# EAGLE schematic top PCB (EAGLE 7.2.0)
CNAME: SHF ROBOTICS; CREVISION: 1; DESIGNER: TOM HULBERT
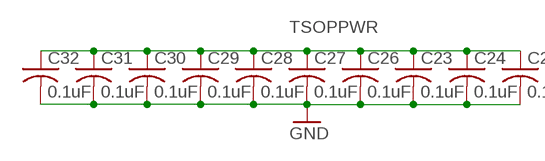
[diagram p0: schematic, sheet 1, part 1 of 2]
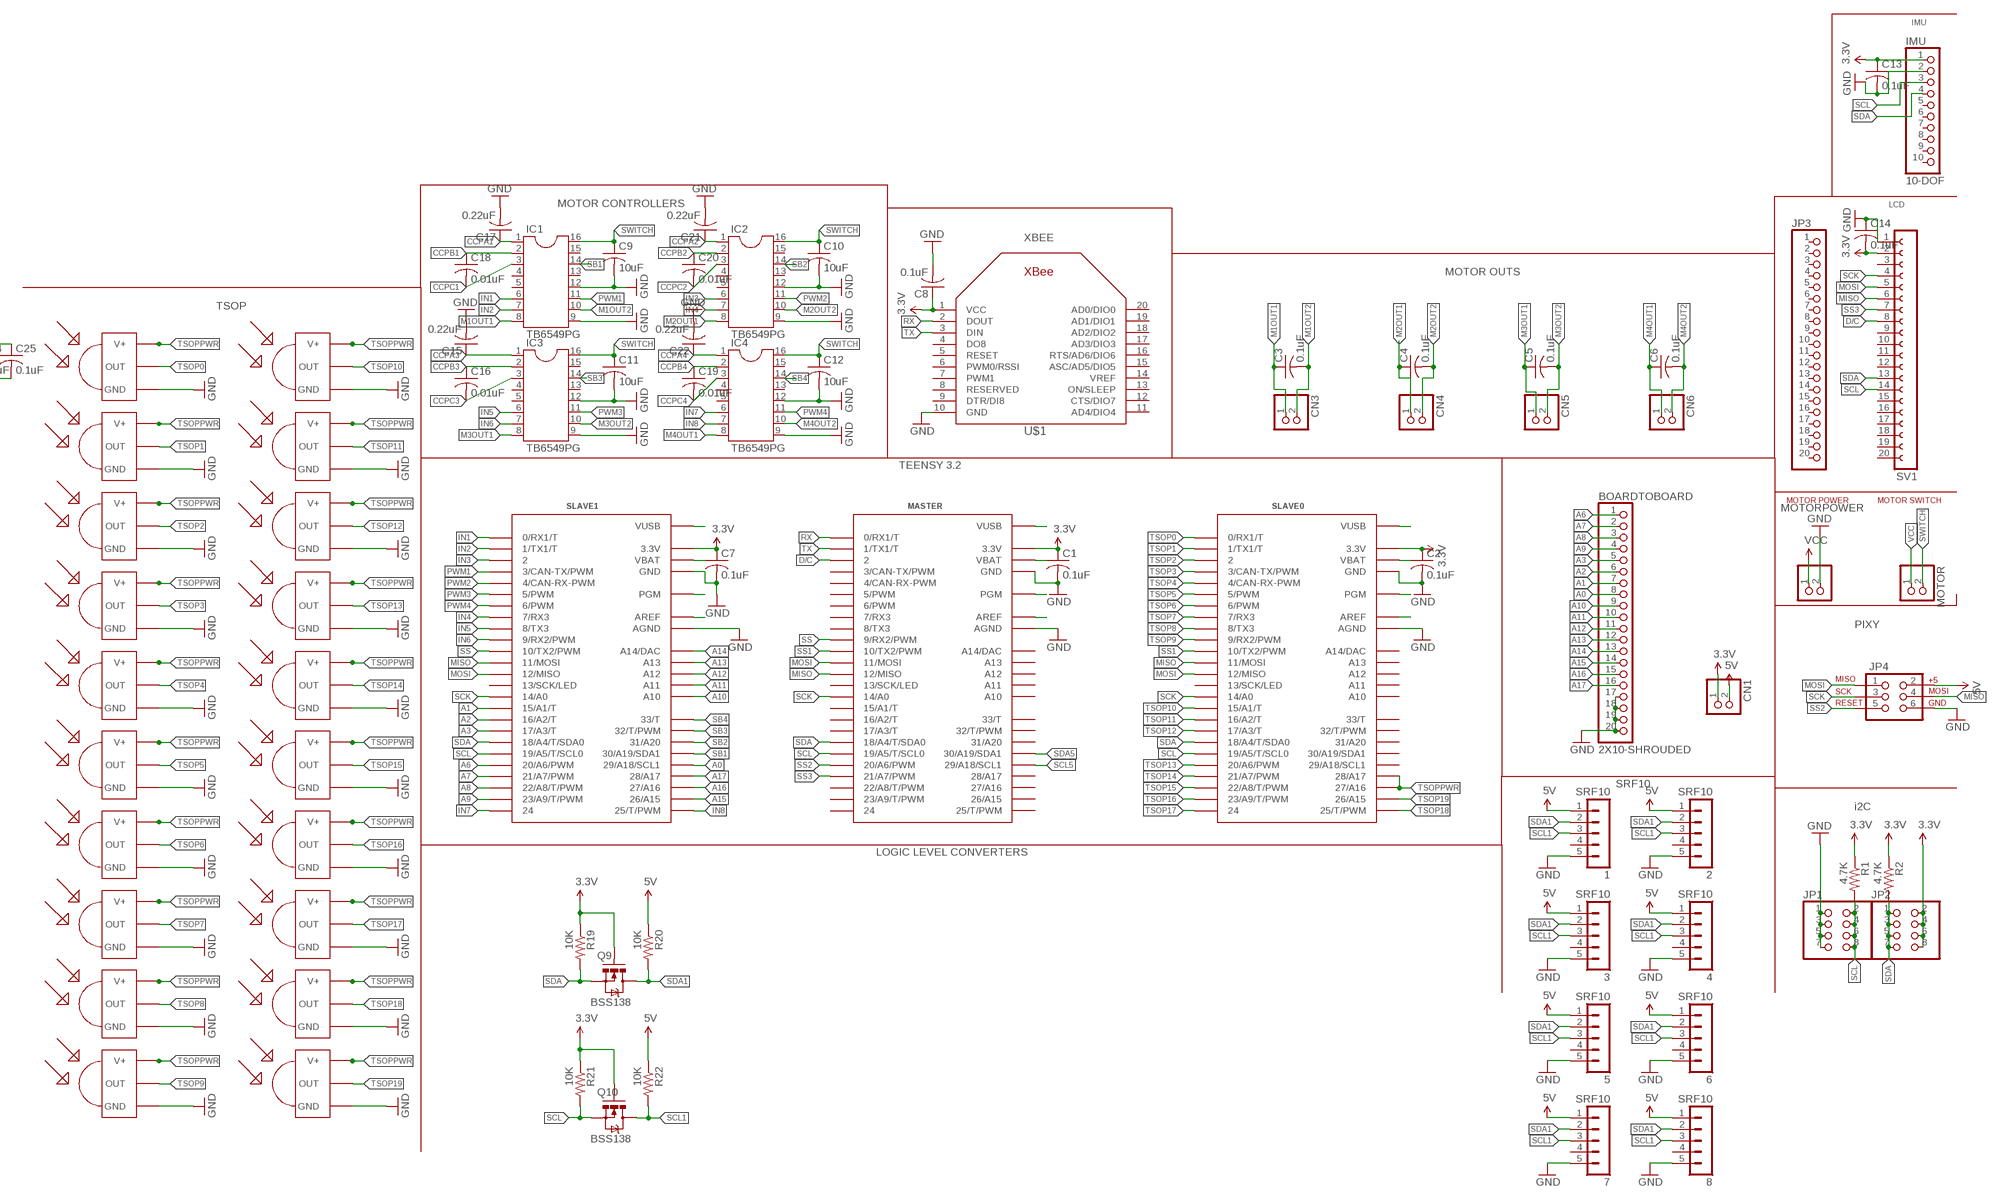
[diagram p1: schematic, sheet 1, part 2 of 2]

## Parts
1  SRF10  MA05-1  [MA05-1]
2  SRF10  MA05-1  [MA05-1]
3  SRF10  MA05-1  [MA05-1]
4  SRF10  MA05-1  [MA05-1]
5  SRF10  MA05-1  [MA05-1]
6  SRF10  MA05-1  [MA05-1]
7  SRF10  MA05-1  [MA05-1]
8  SRF10  MA05-1  [MA05-1]
BOARDTOBOARD  2X10-SHROUDED  [2X10-SHROUDED]
C1  0.1uF  C-USC0805  [C0805]
C2  0.1uF  C-USC0805  [C0805]
C3  0.1uF  C-USC0805  [C0805]
C4  0.1uF  C-USC0805  [C0805]
C5  0.1uF  C-USC0805  [C0805]
C6  0.1uF  C-USC0805  [C0805]
C7  0.1uF  C-USC0805  [C0805]
C8  0.1uF  C-USC0805  [C0805]
C9  10uF  C-USC0805  [C0805]
C10  10uF  C-USC0805  [C0805]
C11  10uF  C-USC0805  [C0805]
C12  10uF  C-USC0805  [C0805]
C13  0.1uF  C-USC0805  [C0805]
C14  0.1uF  C-USC0805  [C0805]
C15  0.22uF  C-USC0805  [C0805]
C16  0.01uF  C-USC0805  [C0805]
C17  0.22uF  C-USC0805  [C0805]
C18  0.01uF  C-USC0805  [C0805]
C19  0.01uF  C-USC0805  [C0805]
C20  0.01uF  C-USC0805  [C0805]
C21  0.22uF  C-USC0805  [C0805]
C22  0.22uF  C-USC0805  [C0805]
C23  0.1uF  C-USC0805  [C0805]
C24  0.1uF  C-USC0805  [C0805]
C25  0.1uF  C-USC0805  [C0805]
C26  0.1uF  C-USC0805  [C0805]
C27  0.1uF  C-USC0805  [C0805]
C28  0.1uF  C-USC0805  [C0805]
C29  0.1uF  C-USC0805  [C0805]
C30  0.1uF  C-USC0805  [C0805]
C31  0.1uF  C-USC0805  [C0805]
C32  0.1uF  C-USC0805  [C0805]
CN1  JST_2PIN-SMT  [JST-PH-2-SMT]
CN3  JST_2PIN-SMT  [JST-PH-2-SMT]
CN4  JST_2PIN-SMT  [JST-PH-2-SMT]
CN5  JST_2PIN-SMT  [JST-PH-2-SMT]
CN6  JST_2PIN-SMT  [JST-PH-2-SMT]
IC1  TB6549PG  DIL16  [DIL16]
IC2  TB6549PG  DIL16  [DIL16]
IC3  TB6549PG  DIL16  [DIL16]
IC4  TB6549PG  DIL16  [DIL16]
IMU  10-DOF  PINHD-1X10  [1X10-BIG]
JP1  PINHD-2X4  [2X04]
JP2  PINHD-2X4  [2X04]
JP3  PINHD-1X20  [1X20]
JP4  AVR_SPI_PRG_6PTH  [2X3]
MASTER  TEENSY_3.1_ALL_PINS_AND_PADS-VIN  [TEENSY_3.1_ALLPINS-VIN]
MOTOR  JST_2PIN-SMT  [JST-PH-2-SMT]
MOTORPOWER  JST_2PIN-SMT  [JST-PH-2-SMT]
Q9  BSS138  MOSFET-NCHANNELSMD  [SOT23-3]
Q10  BSS138  MOSFET-NCHANNELSMD  [SOT23-3]
R1  4.7K  R-US_R0805  [R0805]
R2  4.7K  R-US_R0805  [R0805]
R19  10K  RESISTOR0603-RES  [0603-RES]
R20  10K  RESISTOR0603-RES  [0603-RES]
R21  10K  RESISTOR0603-RES  [0603-RES]
R22  10K  RESISTOR0603-RES  [0603-RES]
SLAVE0  TEENSY_3.1_ALL_PINS_AND_PADS-VIN  [TEENSY_3.1_ALLPINS-VIN]
SLAVE1  TEENSY_3.1_ALL_PINS_AND_PADS-VIN  [TEENSY_3.1_ALLPINS-VIN]
SV1  FE20-1  [FE20]
TSOP1  TSOP1730  [TSOP17XX]
TSOP2  TSOP1730  [TSOP17XX]
TSOP3  TSOP1730  [TSOP17XX]
TSOP4  TSOP1730  [TSOP17XX]
TSOP5  TSOP1730  [TSOP17XX]
TSOP6  TSOP1730  [TSOP17XX]
TSOP7  TSOP1730  [TSOP17XX]
TSOP8  TSOP1730  [TSOP17XX]
TSOP9  TSOP1730  [TSOP17XX]
TSOP10  TSOP1730  [TSOP17XX]
TSOP11  TSOP1730  [TSOP17XX]
TSOP12  TSOP1730  [TSOP17XX]
TSOP13  TSOP1730  [TSOP17XX]
TSOP14  TSOP1730  [TSOP17XX]
TSOP15  TSOP1730  [TSOP17XX]
TSOP16  TSOP1730  [TSOP17XX]
TSOP17  TSOP1730  [TSOP17XX]
TSOP18  TSOP1730  [TSOP17XX]
TSOP19  TSOP1730  [TSOP17XX]
TSOP20  TSOP1730  [TSOP17XX]
U$1  XBEE  [XBEE]

## Nets
3.3V: C1.1 C2.1 C7.1 C8.1 C13.1 C14.2 CN1.1 IMU.1 JP2.2 JP2.4 JP2.6 JP2.8 MASTER.3.3V MASTER.3.3V1(3.3V) MASTER.3.3V2(3.3V) Q9.1(G) Q10.1(G) R1.1 R2.1 R19.1 R21.1 SLAVE0.3.3V SLAVE0.3.3V1(3.3V) SLAVE0.3.3V2(3.3V) SLAVE1.3.3V SLAVE1.3.3V1(3.3V) SLAVE1.3.3V2(3.3V) SV1.2 U$1.1(VCC)
5V: 1.1 2.1 3.1 4.1 5.1 6.1 7.1 8.1 CN1.2 JP4.2 R20.1 R22.1
A0: BOARDTOBOARD.8 SLAVE1.29(29/A18/SCL1)
A1: BOARDTOBOARD.7 SLAVE1.15/A1(15/A1/T)
A2: BOARDTOBOARD.6 SLAVE1.16/A2(16/A2/T)
A3: BOARDTOBOARD.5 SLAVE1.17/A3(17/A3/T)
A6: BOARDTOBOARD.1 SLAVE1.20/A6(20/A6/PWM)
A7: BOARDTOBOARD.2 SLAVE1.21/A7(21/A7/PWM)
A8: BOARDTOBOARD.3 SLAVE1.22/A8(22/A8/T/PWM)
A9: BOARDTOBOARD.4 SLAVE1.23/A9(23/A9/T/PWM)
A10: BOARDTOBOARD.9 SLAVE1.A10
A11: BOARDTOBOARD.10 SLAVE1.A11
A12: BOARDTOBOARD.11 SLAVE1.A12
A13: BOARDTOBOARD.12 SLAVE1.A13
A14: BOARDTOBOARD.13 SLAVE1.A14(A14/DAC)
A15: BOARDTOBOARD.14 SLAVE1.26(26/A15)
A16: BOARDTOBOARD.15 SLAVE1.27(27/A16)
A17: BOARDTOBOARD.16 SLAVE1.28(28/A17)
CCPA1: C17.1 IC1.1
CCPA2: C21.1 IC2.1
CCPA3: C15.1 IC3.1
CCPA4: C22.1 IC4.1
CCPB1: C18.1 IC1.2
CCPB2: C20.1 IC2.2
CCPB3: C16.1 IC3.2
CCPB4: C19.1 IC4.2
CCPC1: C18.2 IC1.3
CCPC2: C20.2 IC2.3
CCPC3: C16.2 IC3.3
CCPC4: C19.2 IC4.3
D/C: MASTER.2 SV1.8
GND: 1.5 2.5 3.5 4.5 5.5 6.5 7.5 8.5 BOARDTOBOARD.17 BOARDTOBOARD.18 BOARDTOBOARD.19 BOARDTOBOARD.20 C1.2 C2.2 C7.2 C8.2 C9.2 C10.2 C11.2 C12.2 C13.2 C14.1 C15.2 C17.2 C21.2 C22.2 C23.2 C24.2 C25.2 C26.2 C27.2 C28.2 C29.2 C30.2 C31.2 C32.2 IC1.9 IC1.12 IC2.9 IC2.12 IC3.9 IC3.12 IC4.9 IC4.12 IMU.2 JP1.1 JP1.3 JP1.5 JP1.7 JP4.6 MASTER.AGND MASTER.GND MASTER.GND1(GND) MASTER.GND2(GND) MOTORPOWER.2 SLAVE0.AGND SLAVE0.GND SLAVE0.GND1(GND) SLAVE0.GND2(GND) SLAVE1.AGND SLAVE1.GND SLAVE1.GND1(GND) SLAVE1.GND2(GND) SV1.1 TSOP1.GND TSOP2.GND TSOP3.GND TSOP4.GND TSOP5.GND TSOP6.GND TSOP7.GND TSOP8.GND TSOP9.GND TSOP10.GND TSOP11.GND TSOP12.GND TSOP13.GND TSOP14.GND TSOP15.GND TSOP16.GND TSOP17.GND TSOP18.GND TSOP19.GND TSOP20.GND U$1.10(GND)
IN1: IC1.6 SLAVE1.0(0/RX1/T)
IN2: IC1.7 SLAVE1.1(1/TX1/T)
IN3: IC2.6 SLAVE1.2
IN4: IC2.7 SLAVE1.7(7/RX3)
IN5: IC3.6 SLAVE1.8(8/TX3)
IN6: IC3.7 SLAVE1.9(9/RX2/PWM)
IN7: IC4.6 SLAVE1.24
IN8: IC4.7 SLAVE1.25(25/T/PWM)
M1OUT1: C3.1 CN3.1 IC1.8
M1OUT2: C3.2 CN3.2 IC1.10
M2OUT1: C4.1 CN4.1 IC2.8
M2OUT2: C4.2 CN4.2 IC2.10
M3OUT1: C5.1 CN5.1 IC3.8
M3OUT2: C5.2 CN5.2 IC3.10
M4OUT1: C6.1 CN6.1 IC4.8
M4OUT2: C6.2 CN6.2 IC4.10
MISO: JP4.4 MASTER.12(12/MISO) SLAVE0.11(11/MOSI) SLAVE1.11(11/MOSI) SV1.6
MOSI: JP4.1 MASTER.11(11/MOSI) SLAVE0.12(12/MISO) SLAVE1.12(12/MISO) SV1.5
NC: SLAVE1.VUSB
NC1: SLAVE1.PGM
NC2: SLAVE1.AREF
NC3: SLAVE1.VBAT
NC4: MASTER.VUSB
NC5: MASTER.VBAT
NC6: MASTER.PGM
NC7: MASTER.AREF
NC8: SLAVE0.VUSB
NC9: SLAVE0.PGM
NC10: SLAVE0.AREF
NC11: SLAVE0.VBAT
PWM1: IC1.11 SLAVE1.3(3/CAN-TX/PWM)
PWM2: IC2.11 SLAVE1.4(4/CAN-RX-PWM)
PWM3: IC3.11 SLAVE1.5(5/PWM)
PWM4: IC4.11 SLAVE1.6(6/PWM)
RX: MASTER.0(0/RX1/T) U$1.2(DOUT)
SB1: IC1.14 SLAVE1.30(30/A19/SDA1)
SB2: IC2.14 SLAVE1.31(31/A20)
SB3: IC3.14 SLAVE1.32(32/T/PWM)
SB4: IC4.14 SLAVE1.33(33/T)
SCK: JP4.3 MASTER.14/A0 SLAVE0.14/A0 SLAVE1.14/A0 SV1.4
SCL: IMU.3 JP1.2 JP1.4 JP1.6 JP1.8 MASTER.19/A5(19/A5/T/SCL0) Q10.2(S) R1.2 R21.2 SLAVE0.19/A5(19/A5/T/SCL0) SLAVE1.19/A5(19/A5/T/SCL0) SV1.14
SCL1: 1.3 2.3 3.3 4.3 5.3 6.3 7.3 8.3 Q10.3(D) R22.2
SCL5: MASTER.29(29/A18/SCL1)
SDA: IMU.4 JP2.1 JP2.3 JP2.5 JP2.7 MASTER.18/A4(18/A4/T/SDA0) Q9.2(S) R2.2 R19.2 SLAVE0.18/A4(18/A4/T/SDA0) SLAVE1.18/A4(18/A4/T/SDA0) SV1.13
SDA1: 1.2 2.2 3.2 4.2 5.2 6.2 7.2 8.2 Q9.3(D) R20.2
SDA5: MASTER.30(30/A19/SDA1)
SS: MASTER.9(9/RX2/PWM) SLAVE1.10(10/TX2/PWM)
SS1: MASTER.10(10/TX2/PWM) SLAVE0.10(10/TX2/PWM)
SS2: JP4.5 MASTER.20/A6(20/A6/PWM)
SS3: MASTER.21/A7(21/A7/PWM) SV1.7
SWITCH: C9.1 C10.1 C11.1 C12.1 IC1.16 IC2.16 IC3.16 IC4.16 MOTOR.2
TSOP0: SLAVE0.0(0/RX1/T) TSOP1.OUT
TSOP1: SLAVE0.1(1/TX1/T) TSOP2.OUT
TSOP2: SLAVE0.2 TSOP3.OUT
TSOP3: SLAVE0.3(3/CAN-TX/PWM) TSOP4.OUT
TSOP4: SLAVE0.4(4/CAN-RX-PWM) TSOP5.OUT
TSOP5: SLAVE0.5(5/PWM) TSOP6.OUT
TSOP6: SLAVE0.6(6/PWM) TSOP7.OUT
TSOP7: SLAVE0.7(7/RX3) TSOP8.OUT
TSOP8: SLAVE0.8(8/TX3) TSOP9.OUT
TSOP9: SLAVE0.9(9/RX2/PWM) TSOP10.OUT
TSOP10: SLAVE0.15/A1(15/A1/T) TSOP11.OUT
TSOP11: SLAVE0.16/A2(16/A2/T) TSOP12.OUT
TSOP12: SLAVE0.17/A3(17/A3/T) TSOP13.OUT
TSOP13: SLAVE0.20/A6(20/A6/PWM) TSOP14.OUT
TSOP14: SLAVE0.21/A7(21/A7/PWM) TSOP15.OUT
TSOP15: SLAVE0.22/A8(22/A8/T/PWM) TSOP16.OUT
TSOP16: SLAVE0.23/A9(23/A9/T/PWM) TSOP17.OUT
TSOP17: SLAVE0.24 TSOP18.OUT
TSOP18: SLAVE0.25(25/T/PWM) TSOP19.OUT
TSOP19: SLAVE0.26(26/A15) TSOP20.OUT
TSOPPWR: C23.1 C24.1 C25.1 C26.1 C27.1 C28.1 C29.1 C30.1 C31.1 C32.1 SLAVE0.27(27/A16) SLAVE0.28(28/A17) TSOP1.V+ TSOP2.V+ TSOP3.V+ TSOP4.V+ TSOP5.V+ TSOP6.V+ TSOP7.V+ TSOP8.V+ TSOP9.V+ TSOP10.V+ TSOP11.V+ TSOP12.V+ TSOP13.V+ TSOP14.V+ TSOP15.V+ TSOP16.V+ TSOP17.V+ TSOP18.V+ TSOP19.V+ TSOP20.V+
TX: MASTER.1(1/TX1/T) U$1.3(DIN)
VCC: MOTOR.1 MOTORPOWER.1
Unconnected: 1.4 2.4 3.4 4.4 5.4 6.4 7.4 8.4 IC1.4 IC1.5 IC1.13 IC1.15 IC2.4 IC2.5 IC2.13 IC2.15 IC3.4 IC3.5 IC3.13 IC3.15 IC4.4 IC4.5 IC4.13 IC4.15 IMU.5 IMU.6 IMU.7 IMU.8 IMU.9 IMU.10 JP3.1 JP3.2 JP3.3 JP3.4 JP3.5 JP3.6 JP3.7 JP3.8 JP3.9 JP3.10 JP3.11 JP3.12 JP3.13 JP3.14 JP3.15 JP3.16 JP3.17 JP3.18 JP3.19 JP3.20 MASTER.3(3/CAN-TX/PWM) MASTER.4(4/CAN-RX-PWM) MASTER.5(5/PWM) MASTER.6(6/PWM) MASTER.7(7/RX3) MASTER.8(8/TX3) MASTER.13(13/SCK/LED) MASTER.15/A1(15/A1/T) MASTER.16/A2(16/A2/T) MASTER.17/A3(17/A3/T) MASTER.22/A8(22/A8/T/PWM) MASTER.23/A9(23/A9/T/PWM) MASTER.24 MASTER.25(25/T/PWM) MASTER.26(26/A15) MASTER.27(27/A16) MASTER.28(28/A17) MASTER.31(31/A20) MASTER.32(32/T/PWM) MASTER.33(33/T) MASTER.A10 MASTER.A11 MASTER.A12 MASTER.A13 MASTER.A14(A14/DAC) SLAVE0.13(13/SCK/LED) SLAVE0.29(29/A18/SCL1) SLAVE0.30(30/A19/SDA1) SLAVE0.31(31/A20) SLAVE0.32(32/T/PWM) SLAVE0.33(33/T) SLAVE0.A10 SLAVE0.A11 SLAVE0.A12 SLAVE0.A13 SLAVE0.A14(A14/DAC) SLAVE1.13(13/SCK/LED) SV1.3 SV1.9 SV1.10 SV1.11 SV1.12 SV1.15 SV1.16 SV1.17 SV1.18 SV1.19 SV1.20 U$1.4(DO8) U$1.5(RESET) U$1.6(PWM0/RSSI) U$1.7(PWM1) U$1.8(RESERVED) U$1.9(DTR/DI8) U$1.11(AD4/DIO4) U$1.12(CTS/DIO7) U$1.13(ON/SLEEP) U$1.14(VREF) U$1.15(ASC/AD5/DIO5) U$1.16(RTS/AD6/DIO6) U$1.17(AD3/DIO3) U$1.18(AD2/DIO2) U$1.19(AD1/DIO1) U$1.20(AD0/DIO0)

## Notes on the sheet
- IMU
- MOTOR CONTROLLERS | LCD
- XBEE
- MOTOR OUTS
- TSOP
- TEENSY 3.2
- MOTOR POWER | MOTOR SWITCH
- PIXY
- SRF10
- i2C
- LOGIC LEVEL CONVERTERS

## Library data of the parts
1-8 = con-lstb:MA05-1: PIN HEADER; OC_FARNELL: unknown; OC_NEWARK: unknown
BOARDTOBOARD = 2x10 Shrouded Header:2X10-SHROUDED
C1-C32 = adafruit:C-US: CAPACITOR, American symbol
CN1 CN3-CN6 MOTOR MOTORPOWER = adafruit:JST_2PIN: JST 2-Pin Connectors of various flavors SMT-RA (S2B-PH-SM4) 4UConnector #17311 SMT (B2B-PH-SM4) THM-RA (S2B-PH) THM (B2B-PH)
IC1-IC4 = ic-package:DIL16: Dual In Line / Socket
IMU = adafruit:PINHD-1X10: Pin header 1x10 0.1" spacing With round pins
JP1 JP2 = adafruit:PINHD-2X4: PIN HEADER
JP3 = adafruit:PINHD-1X20: PIN HEADER
JP4 = SparkFun-Connectors:AVR_SPI_PRG_6: AVR ISP 6 Pin This is the reduced ISP connector for AVR programming. Common on Arduino. This footprint will take up less PCB space and can be used with a 10-pin to 6-pin adapter such as SKU: BOB-08508 **Special note about "TEST_POINT" package. The stop mask is on the top side, so if you want your programming test points to be on the bottom of your board, make sure to place this package on the bottom side of the board. This also ensure that the orientation to program from the bottom side will be correct.
MASTER SLAVE0 SLAVE1 = Teensy_3_Series_Board_v1.0:TEENSY_3.1_ALL_PINS_AND_PADS-VIN: Footprint for Teensy 3.1 board using all pads and all through-holes, with the exception of the VIN pin. Use this option if you want to use an external voltage regulator for the Teensy. Pads need a 2x7 0.1" SMD header.
Q9 Q10 = SparkFun:MOSFET-NCHANNEL
R1 R2 = adafruit:R-US_: RESISTOR, American symbol
R19-R22 = SparkFun:RESISTOR: Resistor Basic schematic elements and footprints for 0603, 1206, and PTH resistors.
SV1 = con-lsta:FE20-1: FEMALE HEADER; OC_FARNELL: unknown; OC_NEWARK: unknown
TSOP1-TSOP20 = tsop:TSOP1730: IR Receiver and Demodulator
U$1 = adafruit:XBEE